# Altium schematic sheet MotorControllers.SchDoc
size A; Organization: Underwater Robotics; Address1: c/o Student Involvement; Address2: Campus Box 7306; Address3: 2016 Cates Ave. Raleigh, NC 27695; SheetNumber: 2E; SheetTotal: 5E
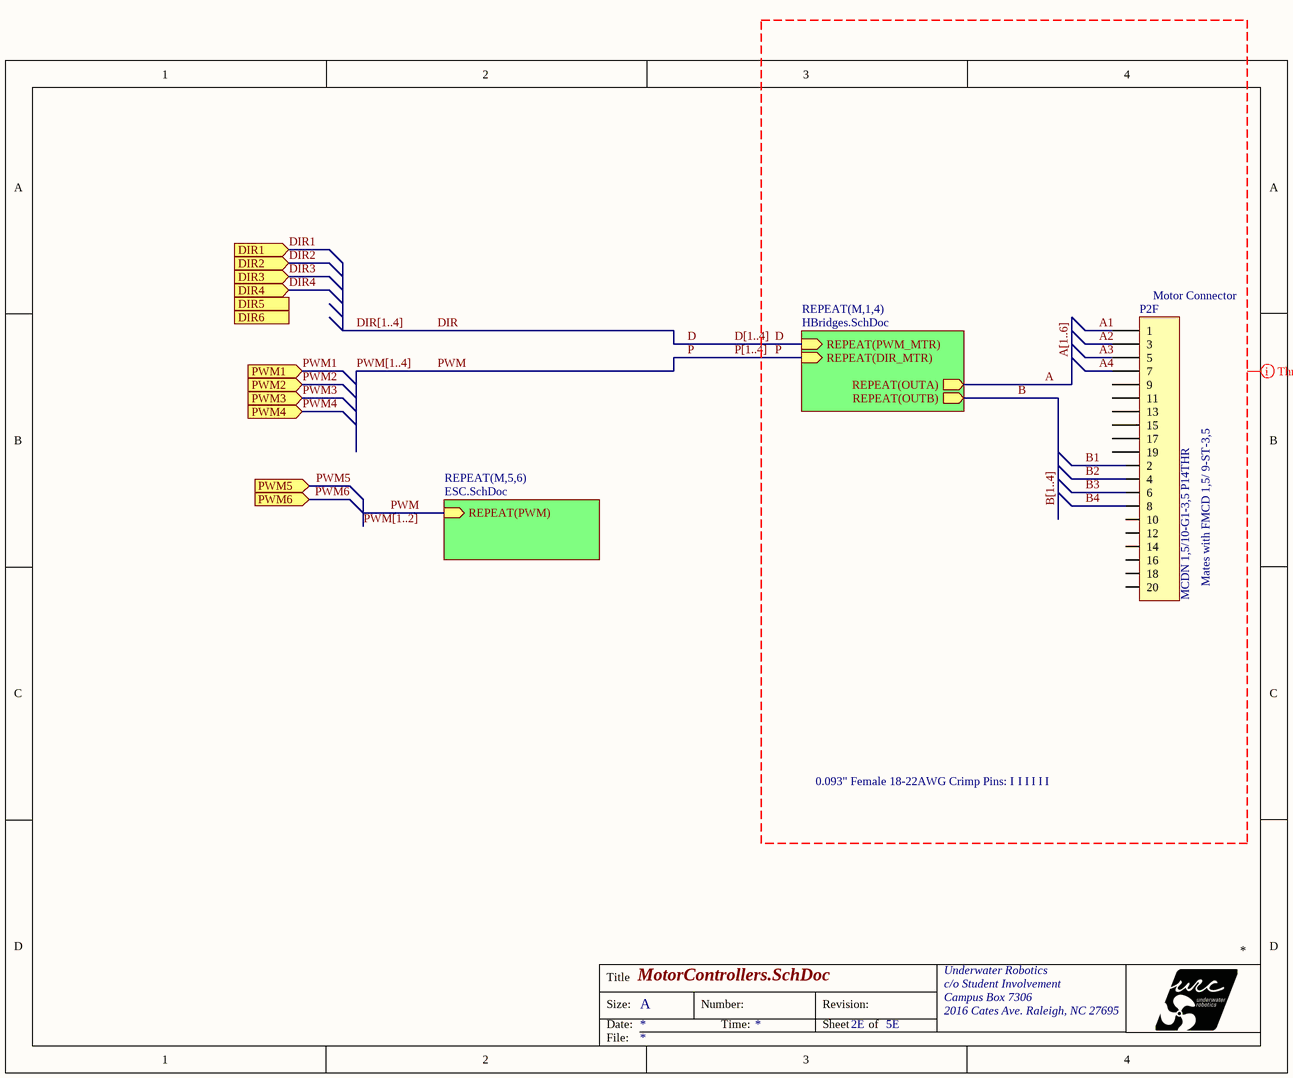
[diagram p0: MotorControllers.SchDoc]

## Parts
i2F  FMCD 1,5/ 9-ST-3,5 (placeholder)  (value not drawn)
i4F  0.093" Crimp Pin, Female (Placeholder)  (value not drawn)
i5F  0.093" Crimp Pin, Female (Placeholder)  (value not drawn)
i6F  0.093" Crimp Pin, Female (Placeholder)  (value not drawn)
i7F  0.093" Crimp Pin, Female (Placeholder)  (value not drawn)
i8F  0.093" Crimp Pin, Female (Placeholder)  (value not drawn)
i9F  0.093" Crimp Pin, Female (Placeholder)  (value not drawn)
P2F  MCDN 1,5/10-G1-3,5 P14THR  [MCDN 1,5/10-G1-3,5 P14THR w/ FMCD 1,5 9-ST-3,5]

## Sub-sheets
REPEAT(M,1,4) = HBridges.SchDoc: REPEAT(OUTA) (out), REPEAT(OUTB) (out), REPEAT(PWM_MTR) (in), REPEAT(DIR_MTR) (in)
REPEAT(M,5,6) = ESC.SchDoc: REPEAT(PWM) (in)

## Ports
DIR1 (in), DIR2 (in), DIR3 (in), DIR4 (in), DIR5 (in), DIR6 (in), PWM1 (in), PWM2 (in), PWM3 (in), PWM4 (in), PWM5 (in), PWM6 (in)

## Nets
A: sheet REPEAT(M,1,4)/REPEAT(OUTA)
A1: P2F.1
A2: P2F.3
A3: P2F.5
A4: P2F.7
B: sheet REPEAT(M,1,4)/REPEAT(OUTB)
B1: P2F.2
B2: P2F.4
B3: P2F.6
B4: P2F.8
D: sheet REPEAT(M,1,4)/REPEAT(PWM_MTR)  [also labelled DIR]
DIR1: port DIR1
DIR2: port DIR2
DIR3: port DIR3
DIR4: port DIR4
P: sheet REPEAT(M,1,4)/REPEAT(DIR_MTR), sheet REPEAT(M,5,6)/REPEAT(PWM)  [also labelled PWM]
PWM1: port PWM1
PWM2: port PWM2
PWM3: port PWM3
PWM4: port PWM4
PWM5: port PWM5
PWM6: port PWM6

Not connected (* = marked no-connect by the designer): P2F 9 10 11 12 13 14 15 16 17 18 19 20

## Buses and harness runs
bus A[1..6]
bus B[1..4]
bus D[1..4]
bus DIR[1..4]
bus P[1..4]
bus PWM[1..2]
bus PWM[1..4]

## Layout directives
net class ThrusterPower: A, A1, A2, A3, A4, A[1..6], B, B1, B2, B3, B4, B[1..4], D, P

## Notes on the sheet
- (near P2F) Motor Connector
- Title
- Size:
- Date:
- A
- Number:
- Time:
- Revision:
- Sheet
- of
- File:
- (in symbol 0.093" Crimp Pin, Female (Placeholder)) 0.093" Female 18-22AWG Crimp Pins: I; I
- (in symbol FMCD 1,5/ 9-ST-3,5 (placeholder)) Mates with FMCD 1,5/ 9-ST-3,5

## Library data of the parts
i2F = FMCD 1,5/ 9-ST-3,5 (placeholder): Manufacturer 1: Phoenix Contact; Manufacturer Part Number: 1738872; Description 1: Pluggable Terminal Blocks 9 Pos 3.5mm pitch Plug 24-16AWG Spring; Connection Method: Spring Cage; Current Rating: 8 A; Number of Positions: 9 Position; Voltage Rating: 160 V; Pitch: 3.5 mm; Wire Gauge Range: 24-16; Supplier 1: Mouser; Supplier Part Number 1: 651-1738872; RoHS: RoHS Compliant; Category: Pluggable Terminal Blocks; Stock 1: 18; Pricing 1: 1=29.42, 10=28.62, 25=27.89, 50=26.75, 100=24.61, 250=22.74, 500=21.66 (AUD); Contact Plating: Tin; Packaging: Bulk; Product: Plugs; Series: FMCD; Termination Style: -; Brand: Phoenix Contact; Product Category: Pluggable Mini Terminal Blocks; Standard Pack Qty: 50; Tradename: COMBICON Control; RoHS - Mouser: Y; Minimum Order Quantity: 1; Reeling: False; ComponentLink1URL: http://www.phoenixcontact.com/us/products/1738872/pdf; ComponentLink1Description: http://www.phoenixcontact.com/us/products/1738872/pdf
i4F i5F i6F i7F i8F i9F = 0.093" Crimp Pin, Female (Placeholder): Standard female crimp pin for 0.093" Molex Connector Series; Description 1: MOLEX - 02-09-1119 - CONTACT, SOCKET, 22-18AWG, CRIMP; Product Range: Standard .093; Wire Size AWG Min: 22; Wire Size AWG Max: 18; Connector Type: Contact, Crimp; Supplier 1: Newark; Supplier Part Number 1: 06H1959; Manufacturer 1: MOLEX; RoHS: YES; Stock 1: 54700; Pricing 1: 1=0.17, 100=0.134, 500=0.109, 1000=0.087, 2000=0.072, 5000=0.062, 10000=0.053 (USD); Contact Gender: Socket; Contact Termination Type: Crimp; Contact Material: Brass; ComponentLink1URL: http://www.farnell.com/cad/1834595.pdf; ComponentLink1Description: http://www.farnell.com/cad/1834595.pdf; ComponentLink2URL: http://www.farnell.com/datasheets/2000530.pdf; ComponentLink2Description: http://www.farnell.com/datasheets/2000530.pdf; Manufacturer Part Number: 02-09-1119
P2F = MCDN 1,5/10-G1-3,5 P14THR: Header, 20-Pin